# Altium schematic sheet DDS_Module.SchDoc: DDS Module
size A; DrawnBy: Tyler White; Engineer: Tyler White; Revision: 0.1; SheetNumber: 4; SheetTotal: 16; SPICEModelCacheSRHMIZMD: <root> / <DocumentId>SRHMIZMD</DocumentId> / </root>
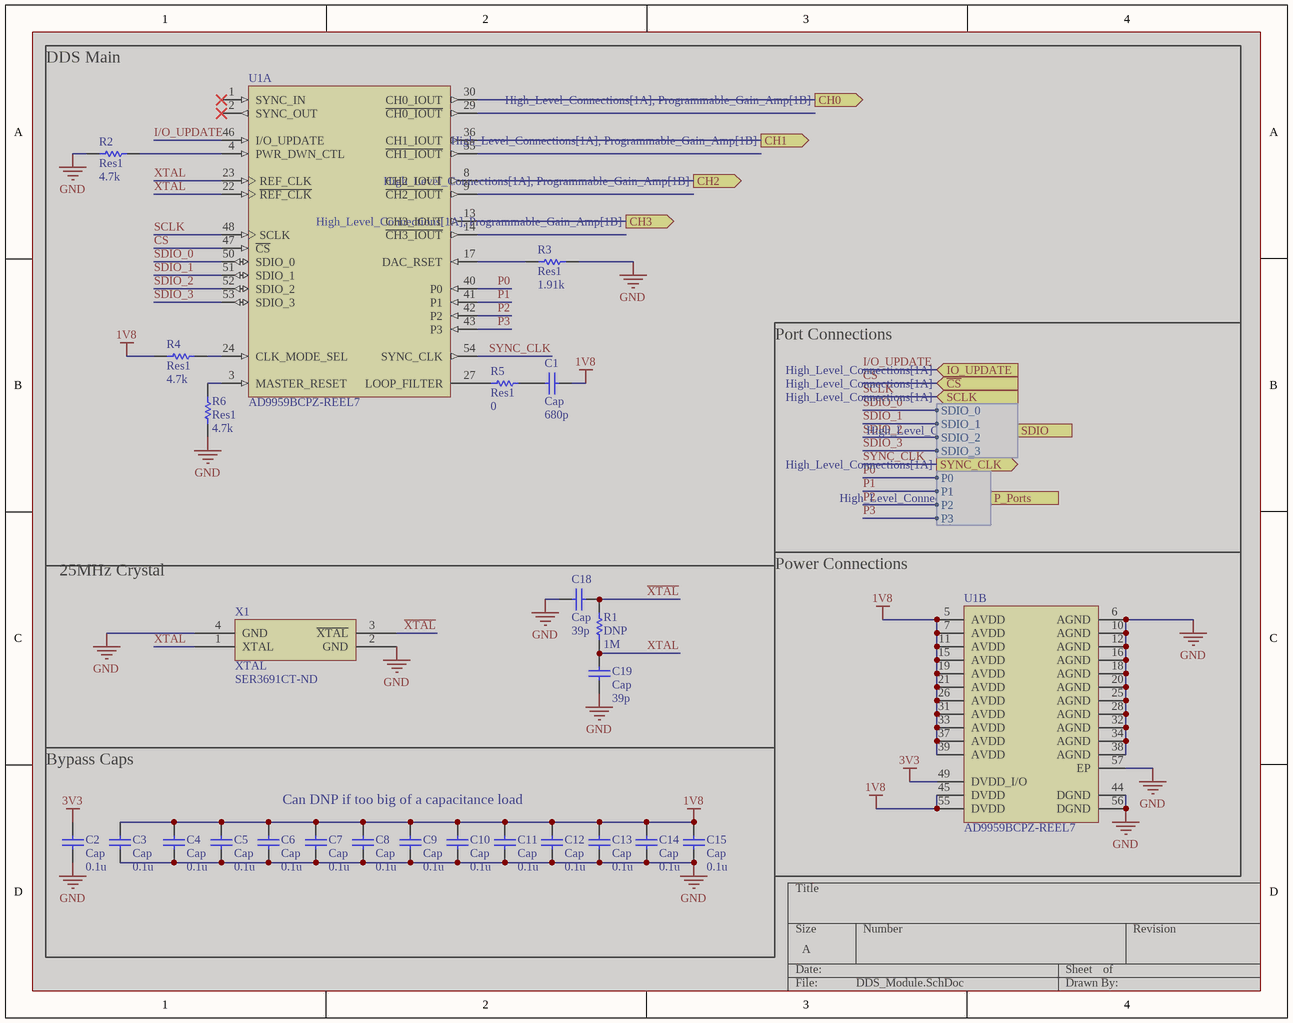
[diagram p0: DDS_Module.SchDoc]

## Parts
C1  Cap  value 680p  [0402_Res]  (masked out: inside a compile mask, not in the netlist)
C2  Cap  value 0.1u  [0402_Res]  (masked out: inside a compile mask, not in the netlist)
C3  Cap  value 0.1u  [0402_Res]  (masked out: inside a compile mask, not in the netlist)
C4  Cap  value 0.1u  [0402_Res]  (masked out: inside a compile mask, not in the netlist)
C5  Cap  value 0.1u  [0402_Res]  (masked out: inside a compile mask, not in the netlist)
C6  Cap  value 0.1u  [0402_Res]  (masked out: inside a compile mask, not in the netlist)
C7  Cap  value 0.1u  [0402_Res]  (masked out: inside a compile mask, not in the netlist)
C8  Cap  value 0.1u  [0402_Res]  (masked out: inside a compile mask, not in the netlist)
C9  Cap  value 0.1u  [0402_Res]  (masked out: inside a compile mask, not in the netlist)
C10  Cap  value 0.1u  [0402_Res]  (masked out: inside a compile mask, not in the netlist)
C11  Cap  value 0.1u  [0402_Res]  (masked out: inside a compile mask, not in the netlist)
C12  Cap  value 0.1u  [0402_Res]  (masked out: inside a compile mask, not in the netlist)
C13  Cap  value 0.1u  [0402_Res]  (masked out: inside a compile mask, not in the netlist)
C14  Cap  value 0.1u  [0402_Res]  (masked out: inside a compile mask, not in the netlist)
C15  Cap  value 0.1u  [0402_Res]  (masked out: inside a compile mask, not in the netlist)
C18  Cap  value 39p  [0402_Res]  (masked out: inside a compile mask, not in the netlist)
C19  Cap  value 39p  [0402_Res]  (masked out: inside a compile mask, not in the netlist)
R1  DNP  value 1M  [0402_Res]  (masked out: inside a compile mask, not in the netlist)
R2  Res1  value 4.7k  [0402_Res]  (masked out: inside a compile mask, not in the netlist)
R3  Res1  value 1.91k  [0402_Res]  (masked out: inside a compile mask, not in the netlist)
R4  Res1  value 4.7k  [0402_Res]  (masked out: inside a compile mask, not in the netlist)
R5  Res1  value 0  [0402_Res]  (masked out: inside a compile mask, not in the netlist)
R6  Res1  value 4.7k  [0402_Res]  (masked out: inside a compile mask, not in the netlist)
U1  AD9959BCPZ-REEL7  [ADI-CP-56-1_L]  (parts A,B of 2)  (masked out: inside a compile mask, not in the netlist)
X1  XTAL  Supplier Part Number 1: SER3691CT-ND  [XTAL_Basic]  (masked out: inside a compile mask, not in the netlist)

## Blocks framed on the sheet
Power Connections: U1
Bypass Caps: C2-C15

## Ports
CH0 (out, see High_Level_Connections[1A], Programmable_Gain_Amp[1B]), CH1 (out, see High_Level_Connections[1A], Programmable_Gain_Amp[1B]), CH2 (out, see High_Level_Connections[1A], Programmable_Gain_Amp[1B]), CH3 (out, see High_Level_Connections[1A], Programmable_Gain_Amp[1B]), IO_UPDATE (in, see High_Level_Connections[1A]), P_Ports (in, harness P, see High_Level_Connections[1A]), SCLK (in, see High_Level_Connections[1A]), SDIO (in, harness SDIO, see High_Level_Connections[1A]), SYNC_CLK (out, see High_Level_Connections[1A]), ~{CS} (in, see High_Level_Connections[1A])

## Harnesses
SDIO: SDIO_0, SDIO_1, SDIO_2, SDIO_3
P: P0, P1, P2, P3

## Notes on the sheet
- DDS Main
- Port Connections
- 25MHz Crystal
- Can DNP if too big of a capacitance load

## Library data of the parts
C1-C15 C18 C19 = Cap: Capacitor; Published: 8-Jun-2000; LatestRevisionDate: 17-Jul-2002; LatestRevisionNote: Re-released for DXP Platform.; PackageReference: RAD-0.3; Publisher: Altium Limited; PackageDescription: Radial Cap, Thru-Hole; 2 Leads; 0.3 in Pin Spacing
R1-R6 = Res1: Resistor; Published: 8-Jun-2000; LatestRevisionDate: 17-Jul-2002; LatestRevisionNote: Re-released for DXP Platform.; PackageReference: AXIAL-0.3; Publisher: Altium Limited; PackageDescription: Axial Device, Thru-Hole; 2 Leads; 0.3 in Pin Spacing
U1 = CMP-0293-00013-1: 4-Channel, 500 MSPS DDS with 10-Bit DACs, Serial, CP-56-1, 750 Reel, Pb-Free; Resolution (Bits): 10bit; I Supply total (max): 180mA; Tuning Word Width (bits): 32bit; REFCLK Multiplier: Yes; FS Iout (mA nom): 10mA; Master fclk: 500MHz; Compliance Range (V): 2.3V; ComponentLink2Description: Datasheet; PackageDescription: 56-Lead Lead Frame Chip Scale Package [LFCSP_VQ]; ComponentLink3URL: http://www.analog.com/static/imported-files/packages/32698137492825CP_56_1.pdf; ComponentLink1URL: www.analog.com; ComponentLink2URL: http://www.analog.com/static/imported-files/data_sheets/AD9959.pdf; ComponentLink1Description: Manufacturer URL; Code_JEDEC: MO-220-VLLD-2; PackageReference: CP-56-1; I/O Interface: Serial; ComponentLink3Description: Package Specification; PackageVersion: 112805-0; DatasheetVersion: Rev. B
X1 = XTAL: ComponentLink1Description: New link; ComponentLink1URL: *; Supplier 1: DigiKey